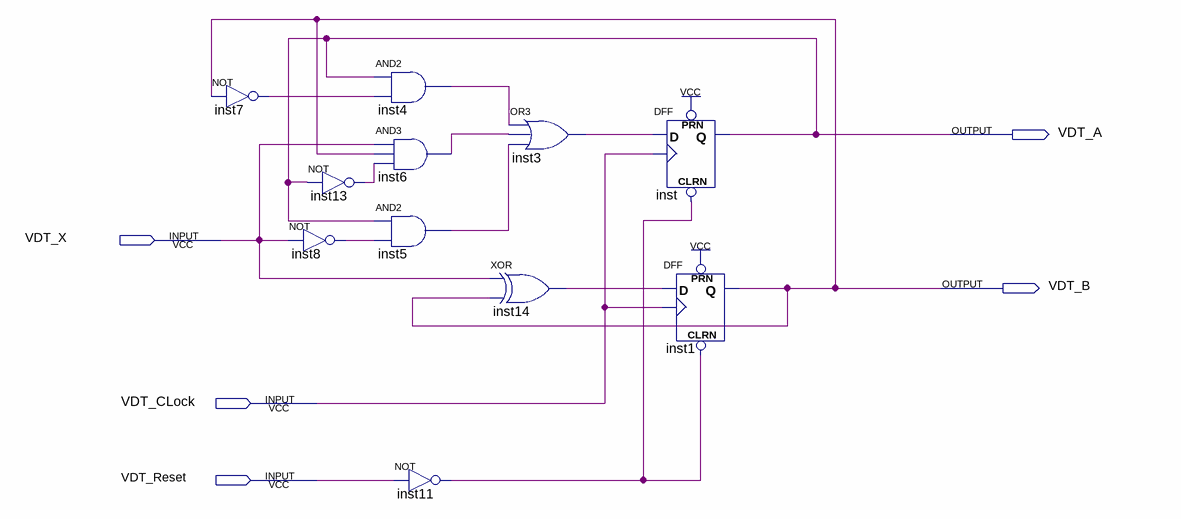
[diagram p0: schematic sheet]
// Quartus schematic assignment3.bdf as structural Verilog: 11 symbols, 5 pins
module assignment3 (
  input  VDT_X,
  input  VDT_CLock,
  input  VDT_Reset,
  output VDT_A,
  output VDT_B
);

  wire inst3_out, inst4_out, inst5_out, inst6_out, inst7_out, inst8_out, inst11_out, inst13_out, inst14_out;

  not inst7 (inst7_out, VDT_B);
  not inst13 (inst13_out, VDT_A);
  not inst8 (inst8_out, VDT_X);
  and inst4 (inst4_out, VDT_A, inst7_out);
  and inst6 (inst6_out, VDT_X, VDT_B, inst13_out);
  and inst5 (inst5_out, VDT_A, inst8_out);
  not inst11 (inst11_out, VDT_Reset);
  xor inst14 (inst14_out, VDT_X, VDT_B);
  or inst3 (inst3_out, inst4_out, inst6_out, inst5_out);
  DFF inst (.CLRN(inst11_out), .CLK(VDT_CLock), .D(inst3_out), .PRN(1'b1), .Q(VDT_A));
  DFF inst1 (.CLRN(inst11_out), .CLK(VDT_CLock), .D(inst14_out), .PRN(1'b1), .Q(VDT_B));
endmodule
